# Altium schematic sheet Ethernet.V03.R00.SchDoc: Comunicación Ethernet
size A4; SheetNumber: 18; SheetTotal: 18
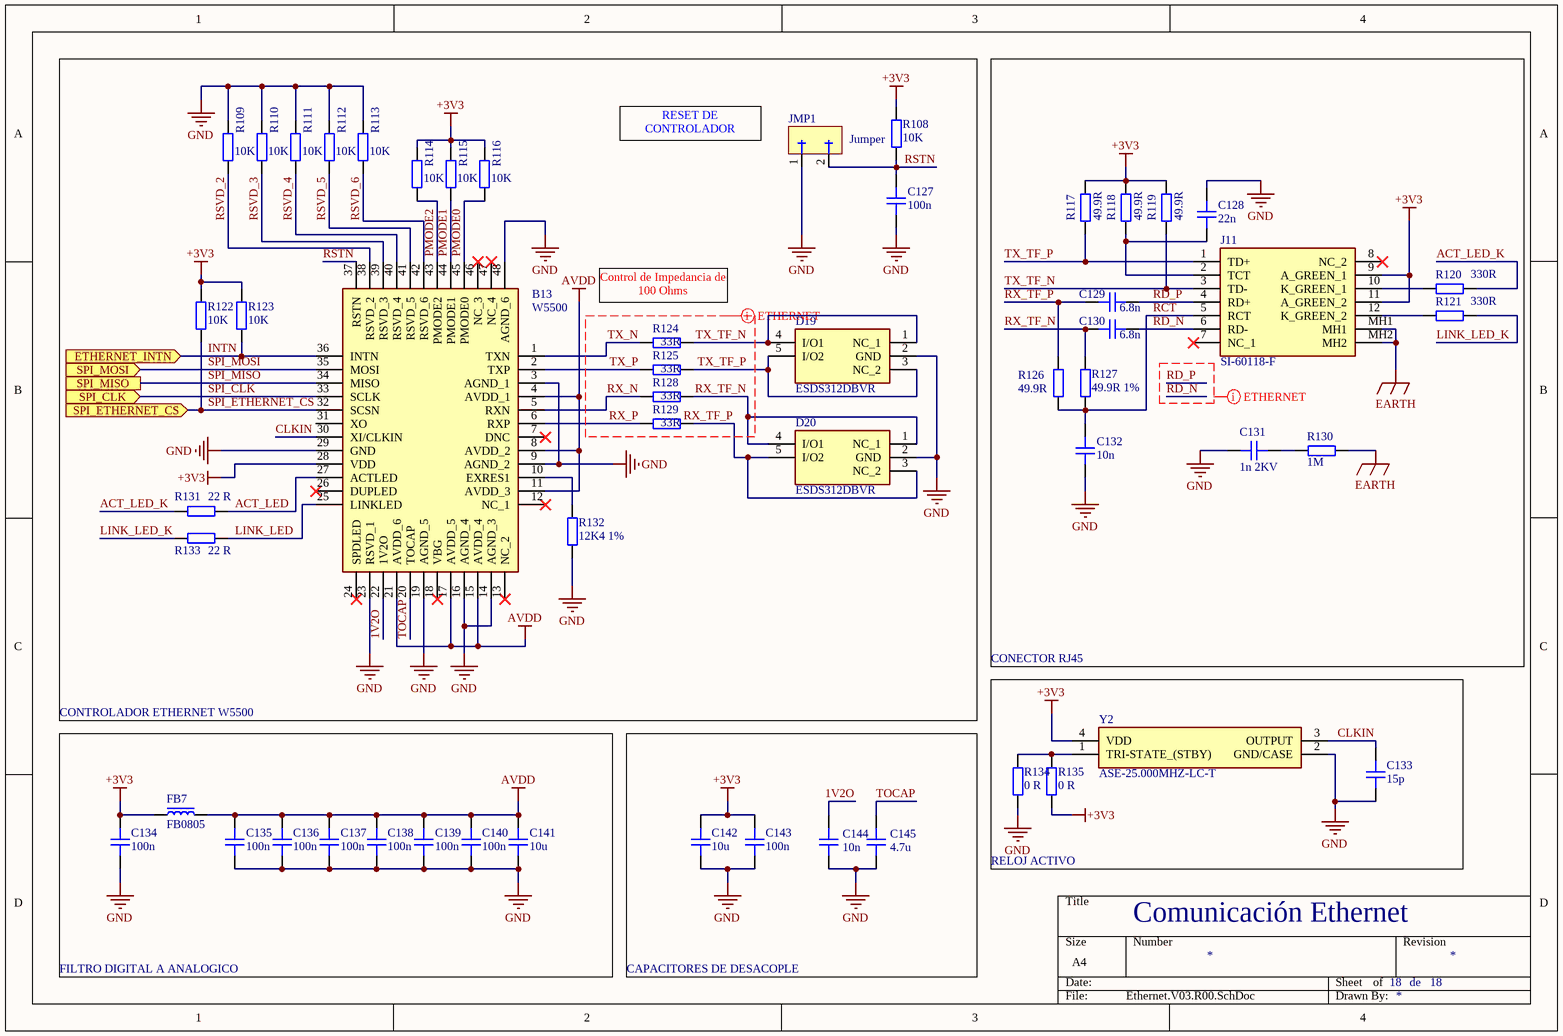
[diagram p0: Ethernet.V03.R00.SchDoc]

## Parts
B13  W5500  [QFP50P900X900X160-48N]
C127  100n  [CAP_0805]
C128  22n  [CAP_0805]
C129  6.8n  [CAP_0805]
C130  6.8n  [CAP_0805]
C131  1n 2KV  [CAP_0805]
C132  10n  [CAP_0805]
C133  15p  [CAP_0805]
C134  100n  [CAP_0805]
C135  100n  [CAP_0805]
C136  100n  [CAP_0805]
C137  100n  [CAP_0805]
C138  100n  [CAP_0805]
C139  100n  [CAP_0805]
C140  100n  [CAP_0805]
C141  10u  [CAP_0805]
C142  10u  [CAP_0805]
C143  100n  [CAP_0805]
C144  10n  [CAP_0805]
C145  4.7u  [CAP_0805]
D19  ESDS312DBVR  [SOT95P280X145-5N]
D20  ESDS312DBVR  [SOT95P280X145-5N]
FB7  FB0805  [FB_0805]
J11  SI-60118-F  [SI60118F]
JMP1  Jumper  [JMP2_TH]
R108  10K  [RES_0805]
R109  10K  [RES_0805]
R110  10K  [RES_0805]
R111  10K  [RES_0805]
R112  10K  [RES_0805]
R113  10K  [RES_0805]
R114  10K  [RES_0805]
R115  10K  [RES_0805]
R116  10K  [RES_0805]
R117  49.9R  [RES_0805]
R118  49.9R  [RES_0805]
R119  49.9R  [RES_0805]
R120  330R  [RES_0805]
R121  330R  [RES_0805]
R122  10K  [RES_0805]
R123  10K  [RES_0805]
R124  33R  [RES_0805]
R125  33R  [RES_0805]
R126  49.9R  [RES_0805]
R127  49.9R 1%  [RES_0805]
R128  33R  [RES_0805]
R129  33R  [RES_0805]
R130  1M  [RES_0805]
R131  22 R  [RES_0805]
R132  12K4 1%  [RES_0805]
R133  22 R  [RES_0805]
R134  0 R  [RES_0805]
R135  0 R  [RES_0805]
Y2  ASE-25.000MHZ-LC-T  [ASE24576MHZLCT]

## Blocks framed on the sheet
CONTROLADOR ETHERNET W5500: B13 C127 D19 D20 JMP1 R108-R116 R122-R125 R128 R129 R131-R133
CONECTOR RJ45: C128-C132 J11 R117-R121 R126 R127 R130
CAPACITORES DE DESACOPLE: C142-C145

## Ports
ETHERNET_INTN (in), SPI_CLK (in), SPI_ETHERNET_CS (in), SPI_MISO, SPI_MOSI (in)

## Nets
+3V3: B13.28(VDD) C134.2 C142.2 C143.2 FB7.1 J11.9(A_GREEN_1) J11.11(A_GREEN_2) R108.1 R114.1 R115.2 R116.2 R117.2 R118.2 R119.2 R122.1 R123.1 R135.1 Y2.4(VDD)
AVDD: B13.4(AVDD_1) B13.8(AVDD_2) B13.11(AVDD_3) B13.15(AVDD_4) B13.17(AVDD_5) B13.21(AVDD_6) C135.2 C136.2 C137.2 C138.2 C139.2 C140.2 C141.2 FB7.2
EARTH: J11.MH1 J11.MH2 R130.2
GND: B13.3(AGND_1) B13.9(AGND_2) B13.14(AGND_3) B13.16(AGND_4) B13.19(AGND_5) B13.23(RSVD_1) B13.29(GND) B13.48(AGND_6) C127.1 C128.2 C131.1 C132.1 C133.1 C134.1 C135.1 C136.1 C137.1 C138.1 C139.1 C140.1 C141.1 C142.1 C143.1 C144.1 C145.1 D19.2(GND) D20.2(GND) JMP1.1 R109.1 R110.1 R111.1 R112.1 R113.1 R132.1 R134.1 Y2.2(GND/CASE)
1V2O: B13.22(1V2O) C144.2
ACT_LED: B13.27(ACTLED) R131.2
ACT_LED_K: R120.2 R131.1
CLKIN: B13.30(XI/CLKIN) C133.2 Y2.3(OUTPUT)
INTN: B13.36(INTN) R123.2 ; port ETHERNET_INTN
LINK_LED: B13.25(LINKLED) R133.2
LINK_LED_K: R121.2 R133.1
PMODE0: B13.45(PMODE0) R116.1
PMODE1: B13.44(PMODE1) R115.1
PMODE2: B13.43(PMODE2) R114.2
RCT: C132.2 J11.5(RCT) R126.1 R127.1
RD_N: C130.2 J11.6(RD-)
RD_P: C129.2 J11.4(RD+)
RSTN: B13.37(RSTN) C127.2 JMP1.2 R108.2
RSVD_2: B13.38(RSVD_2) R109.2
RSVD_3: B13.39(RSVD_3) R110.2
RSVD_4: B13.40(RSVD_4) R111.2
RSVD_5: B13.41(RSVD_5) R112.2
RSVD_6: B13.42(RSVD_6) R113.2
RX_N: B13.5(RXN) R128.2
RX_P: B13.6(RXP) R129.2
RX_TF_N: C130.1 D20.1(NC_1) D20.4(I/O1) R127.2 R128.1
RX_TF_P: C129.1 D20.3(NC_2) D20.5(I/O2) R126.2 R129.1
SPI_CLK: B13.33(SCLK) ; port SPI_CLK
SPI_ETHERNET_CS: B13.32(SCSN) R122.2 ; port SPI_ETHERNET_CS
SPI_MISO: B13.34(MISO) ; port SPI_MISO
SPI_MOSI: B13.35(MOSI) ; port SPI_MOSI
TOCAP: B13.20(TOCAP) C145.2
TX_N: B13.1(TXN) R124.2
TX_P: B13.2(TXP) R125.2
TX_TF_N: D19.1(NC_1) D19.4(I/O1) J11.3(TD-) R119.1 R124.1
TX_TF_P: D19.3(NC_2) D19.5(I/O2) J11.1(TD+) R117.1 R125.1
NetB13_10: B13.10(EXRES1) R132.2
NetC128_1: C128.1 J11.2(TCT) R118.1
NetC131_2: C131.2 R130.1
NetJ11_10: J11.10(K_GREEN_1) R120.1
NetJ11_12: J11.12(K_GREEN_2) R121.1
NetR134_2: R134.2 R135.2 Y2.1(TRI-STATE_(STBY))

Not connected (* = marked no-connect by the designer): B13 7(DNC)* 12(NC_1)* 13(NC_2)* 18(VBG)* 24(SPDLED)* 26(DUPLED)* 31(XO) 46(NC_3)* 47(NC_4)*; J11 7(NC_1)* 8(NC_2)*

## Layout directives
differential pair; differential pair class ETHERNET; rule Differential Pairs Routing [Pref Gap = 0.325mm    Min Gap  = 0.127mm    Max Gap  = 0.325mmPref Width = 0.13mm    Min Width  = 0.13mm    Max Width  = 0.13mm]; rule Matched Net Lengths [Tolerance = 1mm]; net class ETHERNET: RD_N, RD_P, RX_N, RX_P, RX_TF_N, RX_TF_P, TX_N, TX_P, TX_TF_N, TX_TF_P

## Notes on the sheet
- (near JMP1) RESET DE CONTROLADOR
- (near R124) Control de Impedancia de 100 Ohms
- RELOJ ACTIVO
- FILTRO DIGITAL A ANALOGICO
- de

## Library data of the parts
B13 = W5500: Ethernet ICs 3in1 Enet Controller TCP/IP +MAC+PHY; Manufacturer_Name: WIZnet Inc; Geometry.Height: 1.6mm; Mouser Part Number: 950-W5500; Mouser Price/Stock: https://www.mouser.co.uk/ProductDetail/WIZnet/W5500?qs=2vh%252B45pPFtzthUpYPd4pqA%3D%3D; Manufacturer_Part_Number: W5500; Datasheet Link: http://wizwiki.net/wiki/lib/exe/fetch.php?media=products:w5500:w5500_ds_v106e_141230.pdf
C127-C145 = CAP_0805: Capacitor SMD 0805; Manufacturer: *; Manufacturer Part Number: *; Distributor Link: *; LCSC: *; Rating: *; Dielectric: *
D19 D20 = ESDS312DBVR: 3.6V Data-Line Surge and 30kV ESD Protection Diode Array; Manufacturer_Name: Texas Instruments; Geometry.Height: 1.45mm; Mouser Part Number: 595-ESDS312DBVR; Mouser Price/Stock: https://www.mouser.co.uk/ProductDetail/Texas-Instruments/ESDS312DBVR?qs=byeeYqUIh0PGNqB7QuJpTA%3D%3D; Manufacturer_Part_Number: ESDS312DBVR; Datasheet Link: http://www.ti.com/lit/gpn/esds312
FB7 = FB_0805: Ferrite Bead SMD 0805; Manufacturer: *; Manufacturer Part Number: *; Distributor Link: *; LCSC: *
J11 = SI-60118-F: MagJack 10/100BASE-T; Manufacturer_Name: BelFuse; Geometry.Height: 15.21mm; Mouser Part Number: 530-SI-60118-F; Mouser Price/Stock: https://www.mouser.com/Search/ProductDetail.aspx?qs=SRYZG9HaIQ1pVFtjOaj56g%3d%3d; Manufacturer_Part_Number: SI-60118-F; Datasheet Link: https://componentsearchengine.com/Datasheets/1/SI-60118-F.pdf
JMP1 = JMP2_TH: Jumper 2 Pins Through-Hole DO NOT PLACE
R108-R135 = RES_0805: Resistor SMD 0805; Manufacturer: *; Manufacturer Part Number: *; Distributor Link: *; LCSC: *
Y2 = ASE-25.000MHZ-LC-T: Crystal or Oscillator; Manufacturer_Name: ABRACON; Datasheet Link: https://abracon.com/Oscillators/ASEseries.pdf; Height: 1.2mm; Manufacturer_Part_Number: ASE-25.000MHZ-LC-T; Mouser Part Number: 815-ASE25.000MHZLCT; Mouser Price/Stock: https://www.mouser.co.uk/ProductDetail/ABRACON/ASE-25.000MHZ-LC-T?qs=ShQ8XZQtgRuW6p4KtHOZPQ%3D%3D; Arrow Part Number: ASE-25.000MHZ-LC-T; Arrow Price/Stock: https://www.arrow.com/en/products/ase-25.000mhz-lc-t/abracon?utm_currency=USD&region=nac